# Altium schematic sheet Switches.SchDoc
size A4; Organization: Altium Limited; Address1: L3, 12a Rodborough Rd; Address2: Frenchs Forest; Address3: NSW; Address4: Australia 2086
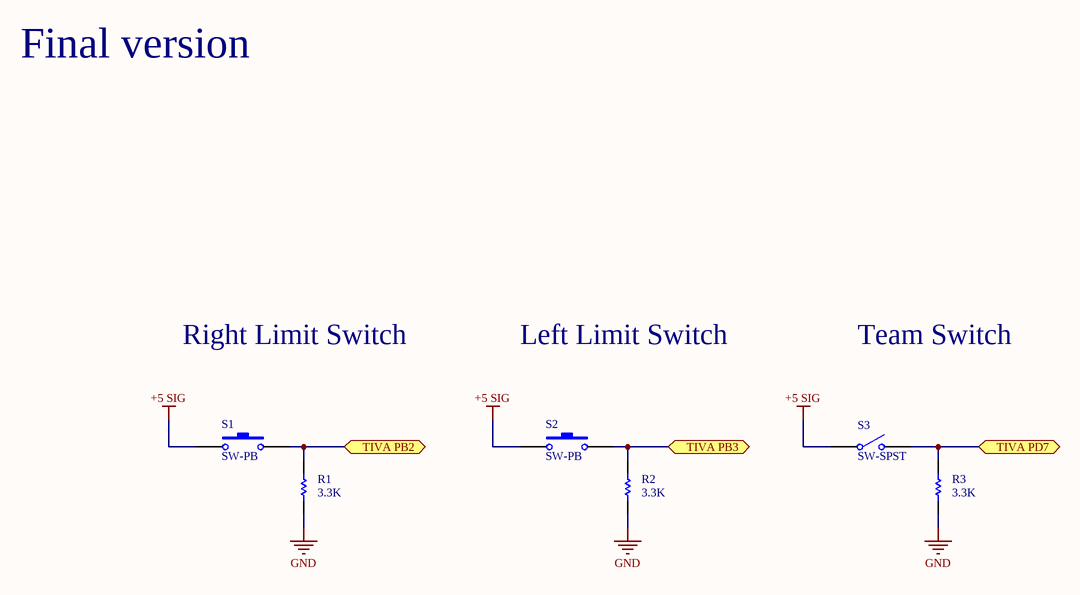
[diagram p0: Switches.SchDoc]

## Parts
R1  value 3.3K  [AXIAL-0.3]  (hidden comment: Res1)
R2  value 3.3K  [AXIAL-0.3]  (hidden comment: Res1)
R3  value 3.3K  [AXIAL-0.3]  (hidden comment: Res1)
S1  SW-PB  [SPST-2]
S2  SW-PB  [SPST-2]
S3  SW-SPST  [SPST-2]

## Ports
TIVA PB2, TIVA PB3, TIVA PD7

## Nets
+5 SIG: S1.1 S2.1 S3.1(COMMON)
GND: R1.1 R2.1 R3.1
TIVA PB2: R1.2 S1.2 ; port TIVA PB2
TIVA PB3: R2.2 S2.2 ; port TIVA PB3
TIVA PD7: R3.2 S3.2(NO) ; port TIVA PD7

## Notes on the sheet
- Final version
- Right Limit Switch
- Left Limit Switch
- Team Switch
- Title
- Size:
- Date:
- A4
- Number:
- Time:
- Revision:
- Sheet
- of
- File:

## Library data of the parts
R1-R3 = Res1: Resistor; Manufacturer: Generic Components; Class: Passive; Published: 08/06/2000; Publisher: Altium Hobart Technology Centre; SubClass: Resistor
S1 S2 = SW-PB: Switch; Manufacturer: Generic Components; Published: 1999
S3 = SW-SPST: Single-Pole, Single-Throw Switch; Manufacturer: Generic Components; Published: 1999